# EAGLE design connector_board (EAGLE 9.5.2)
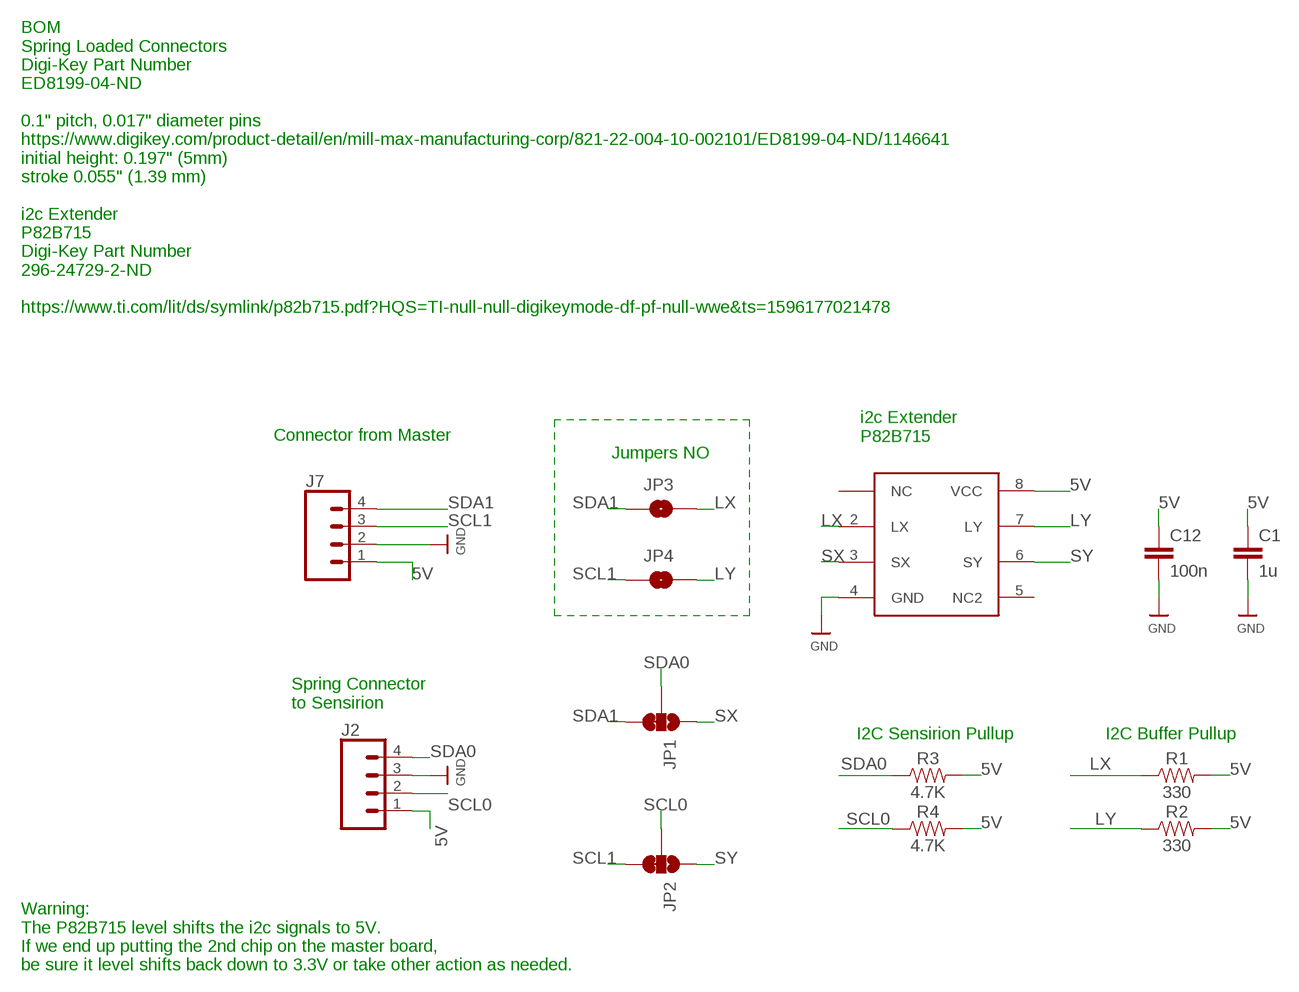
[diagram p0: schematic, sheet 1]

## Parts
C1  1u  CAP-0805  [0805]
C12  100n  CAP-0805  [0805]
J2  CONN_0430MILL_DIA  [1X04_30MILL_DIA]
J7  CONN_043.5MM_RA  [1X04_3.5MM_RA]
JP1  JUMPER-SMT_3_1-NC_TRACE_NO-SILK  [SMT-JUMPER_3_1-NC_TRACE_NO-SILK]
JP2  JUMPER-SMT_3_1-NC_TRACE_NO-SILK  [SMT-JUMPER_3_1-NC_TRACE_NO-SILK]
JP3  JUMPER-SMT_2_NO_SILK  [SMT-JUMPER_2_NO_SILK]
JP4  JUMPER-SMT_2_NO_SILK  [SMT-JUMPER_2_NO_SILK]
R1  330  0.3OHM-0805-1/8W-1%  [0805]
R2  330  0.3OHM-0805-1/8W-1%  [0805]
R3  4.7K  0.3OHM-0805-1/8W-1%  [0805]
R4  4.7K  0.3OHM-0805-1/8W-1%  [0805]
U$2  P82B715  [SOIC8]

## Nets
5V: C1.1 C12.1 J2.1 J7.1 R1.2 R2.2 R3.2 R4.2 U$2.8(VCC)
GND: C1.2 C12.2 J2.3 J7.2 U$2.4(GND)
LX: JP3.2 R1.1 U$2.2(LX)
LY: JP4.2 R2.1 U$2.7(LY)
SCL0: J2.2 JP2.2 R4.1
SCL1: J7.3 JP2.3 JP4.1
SDA0: J2.4 JP1.2 R3.1
SDA1: J7.4 JP1.3 JP3.1
SX: JP1.1 U$2.3(SX)
SY: JP2.1 U$2.6(SY)
Unconnected: U$2.1(NC) U$2.5(NC2)

## Notes on the sheet
- BOM
  Spring Loaded Connectors 
  Digi-Key Part Number
  ED8199-04-ND
  
  0.1" pitch, 0.017" diameter pins
  https://www.digikey.com/product-detail/en/mill-max-manufacturing-corp/821-22-004-10-002101/ED8199-04-ND/1146641
  initial height: 0.197" (5mm)
  stroke 0.055" (1.39 mm)
  
  i2c Extender
  P82B715 
  Digi-Key Part Number
  296-24729-2-ND
  
  https://www.ti.com/lit/ds/symlink/p82b715.pdf?HQS=TI-null-null-digikeymode-df-pf-null-wwe&ts=1596177021478
- i2c Extender
  P82B715
- Connector from Master
- Jumpers NO
- Spring Connector
  to Sensirion
- I2C Sensirion Pullup | I2C Buffer Pullup
- Warning:
  The P82B715 level shifts the i2c signals to 5V.
  If we end up putting the 2nd chip on the master board, 
  be sure it level shifts back down to 3.3V or take other action as needed.

## Library data of the parts
C1 C12 = SparkFun-Capacitors:CAP
J2 J7 = th_libraries:CONN_04: Multi connection point. Often used as Generic Header-pin footprint for 0.1 inch spaced/style header connections On any of the 0.1 inch spaced packages, you can populate with these: Break Away Headers - Straight <https://www.sparkfun.com/products/116> (PRT-00116) Break Away Male Headers - Right Angle <https://www.sparkfun.com/products/553> (PRT-00553) Female Headers <https://www.sparkfun.com/products/115> (PRT-00115) Break Away Headers - Machine Pin <https://www.sparkfun.com/products/117> (PRT-00117) Break Away Female Headers - Swiss Machine Pin <https://www.sparkfun.com/products/743> (PRT-00743) For SCREWTERMINALS and SPRING TERMINALS visit here: Screw Terimnals on SparkFun.com <https://www.sparkfun.com/search/results?term=Screw+Terminals> (5mm/3.5mm/2.54mm spacing) This device is also useful as a general connection point to wire up your design to another part of your project. Our various solder wires solder well into these plated through hole pads. Hook-Up Wire - Assortment (Stranded, 22 AWG) <https://www.sparkfun.com/products/11375> (PRT-11375) Hook-Up Wire - Assortment (Solid Core, 22 AWG) <https://www.sparkfun.com/products/11367> (PRT-11367) View the entire wire category on our website here <https://www.sparkfun.com/categories/141> Special notes: Molex polarized connector foot print use with SKU : PRT-08231 with associated crimp pins and housings. 1MM SMD Version SKU: PRT-10208
JP1 JP2 = SparkFun-Jumpers:JUMPER-SMT_3_1-NC_TRACE: Normally closed trace jumper (1 of 2 connections) This jumper has a trace between two pads so it's normally closed (NC). The other connection is normally open (NO). Use a razor knife to open the connection. For best results follow the IPC guidelines for cutting traces: Cutout at least 0.063 mm (0.005 in). Remove all loose material to clean up the cut area. Seal the cut with an approved epoxy. Reapply solder to reclose the connection, or to close the NO connection.
JP3 JP4 = SparkFun-Jumpers:JUMPER-SMT_2_NO: Normally open jumper This jumper has two pads in close proximity to each other. Apply solder to close the connection. Round pads are easier to solder for beginners, but are a lot larger. SparkFun Product that uses the round pads: SparkFun EL Sequencer <https://www.sparkfun.com/products/12781>
R1-R4 = SparkFun-Resistors:0.3OHM: 0.3Ω resistor A resistor is a passive two-terminal electrical component that implements electrical resistance as a circuit element. Resistors act to reduce current flow, and, at the same time, act to lower voltage levels within circuits. - Wikipedia; PROD_ID: RES-11622; VALUE: 0.3
U$2 = th_libraries:P82B715: i2c Extender P82B715 https://www.nxp.com/docs/en/data-sheet/P82B715.pdf Soic8

## Board
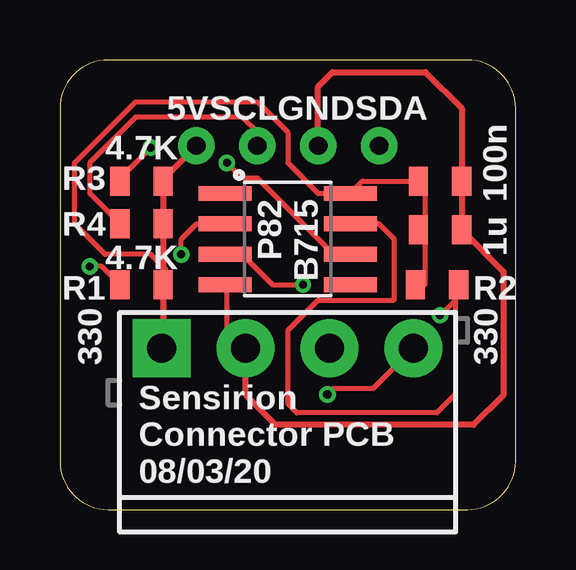
[diagram p1: board, top side]
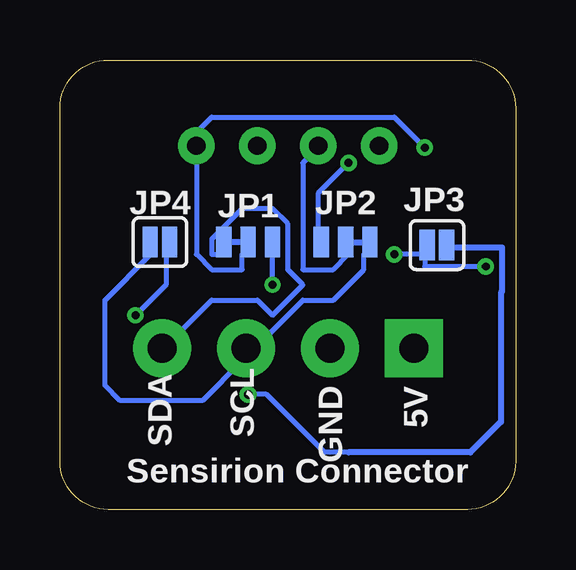
[diagram p2: board, bottom side, seen from below]

Size 19 x 18.73 mm. Coordinates in mm from the lower left corner, seen from the top.
Outline: 17,0 arc90 19,2 19,16.73 arc90 17,18.73 2,18.73 arc90 0,16.73 0,2 arc90 2,0 17,0
Copper layers (1*16): Top 0.0356mm / dielectric 1.5011mm / Bottom 0.0356mm
Design rules "LaenPCBOrder *": minimum track width 8mil, minimum drill 13mil, track to track 8mil, track to pad 8mil, pad to pad 8mil, via to via 8mil, smd to smd 6mil, copper to edge 15mil, drill to drill 6mil, minimum pad ring 7mil, minimum via ring 7mil, stop-mask expansion 3mil, vias tented up to drill 25mil, thermal gap 10mil

### Footprints (pad centres in the part's own frame; a part is rotated, then mirrored left to right if it is on the bottom)
0805 = smd 0.8 x 1.2: 1 -0.9,0; 2 0.9,0
1X04_30MILL_DIA = drill 0.762 pad 1.524: 1 0,0; 2 2.54,0; 3 5.08,0; 4 7.62,0
1X04_3.5MM_RA = drill 1.2 pad 2.413 square: 1 -0.228,0.023 | drill 1.2 pad 2.413: 2 3.272,0.023; 3 6.772,0.023; 4 10.272,0.023
SMT-JUMPER_3_1-NC_TRACE_NO-SILK = smd 0.635 x 1.27: 1 -1.016,0; 2 0,0; 3 1.016,0
SMT-JUMPER_2_NO_SILK = smd 0.635 x 1.27: 1 -0.406,0; 2 0.406,0
SOIC8 = smd 0.61 x 2.21: 1 -1.905,-2.616; 2 -0.635,-2.616; 3 0.635,-2.616; 4 1.905,-2.616; 5 1.905,2.616; 6 0.635,2.616; 7 -0.635,2.616; 8 -1.905,2.616

### Placement (x,y rotation side)
C1  15.85,11.65 0 top
C12  15.85,13.68 0 top
J2  5.69,15.16 0 top
J7  4.47,6.7 0 top
JP1  11.15,11.14 180 bottom
JP2  7.09,11.14 0 bottom
JP3  3.28,11.02 180 bottom
JP4  14.83,11.14 0 bottom
R1  3.4,9.37 0 top
R2  15.72,9.37 180 top
R3  3.4,13.68 0 top
R4  3.4,11.9 0 top
U$2  9.5,11.27 270 top

### Tracks (layer width: path | path; a pad name or v marks a point on that pad's centre or on a via)
5V
  Top 0.203: R2.2 15.21,9.37 15.21,11.27 C1.1 15.21,11.9 15.21,13.18 C12.1 12.62,13.68 U$2.8 10.77,13.18 9.5,14.44 9.5,15.71 8.23,16.99 3.15,16.99 0.61,14.44 0.61,11.9 1.88,10.63 3.78,10.63 4.42,10 4.3,10
  Top 0.254: J2.1 4.3,13.77 R3.2 R4.2 4.3,10 R1.2 4.3,6.78 J7.1
GND
  Top 0.203: U$2.4 6.96,9.37 6.96,7.46 7.59,6.82 J7.2
  Top 0.254: J2.3 10.77,17.62 11.37,18.22 15.25,18.22 16.75,16.72 C12.2 C1.2 18.49,9.91 18.49,4.77 17.25,3.52 8.99,3.52 7.74,4.77 J7.2
LX  (via drill 0.33)
  Top 0.203: v1.25,10.13 1.74,10.13 R1.1 2.51,9.37 | U$2.2 5.69,11.9 5.06,11.27 v5.06,10.63
  Bottom 0.203: v1.25,10.13 3.78,10.13 3.78,10.63 | 3.78,10.63 v5.06,10.63 | 3.78,10.63 JP3.2
LY  (via drill 0.33)
  Top 0.203: 16.49,8.73 16.49,9.37 R2.1 | v15.85,8.09 16.49,8.73 | U$2.7 13.31,11.9 13.94,11.27 13.94,8.73 10.77,8.73 9.5,7.46 9.5,4.41 9.88,4.03 15.72,4.03 16.49,4.79 16.49,8.73
  Bottom 0.203: v15.85,8.09 14.58,9.37 14.58,10.63 JP4.2
SCL0
  Top 0.203: R4.1 2.51,11.9 1.25,13.18 1.25,14.44 3.15,16.35 7.59,16.35 8.23,15.71 J2.2
  Bottom 0.203: JP2.2 6.96,10.63 7.59,10 8.87,10 8.87,14.44 8.23,15.08 J2.2
SCL1
  Bottom 0.203: JP4.1 15.21,10.63 17.12,8.73 17.12,5.17 16.49,4.54 13.06,4.54 11.4,6.19 J7.3 10.77,6.82 8.87,8.73 7.59,8.73 6.32,10 6.32,10.63 JP2.3
SDA0  (via drill 0.33)
  Top 0.203: v3.78,15.08 2.51,13.81 R3.1
  Bottom 0.203: v3.78,15.08 5.06,16.35 12.68,16.35 13.31,15.71 J2.4 13.31,10.63 12.68,10 11.4,10 11.4,10.63 JP1.2
SDA1  (via drill 0.35)
  Top 0.203: v11.15,4.79 11.4,5.05 13.07,5.05 J7.4
  Bottom 0.203: JP1.3 12.04,10.63 12.68,10.63 12.68,11.27 11.4,12.54 10.13,12.54 9.5,11.9 9.5,10 8.87,9.37 10.13,8.09 10.77,8.73 12.68,8.73 14.58,6.82 J7.4 | 6.96,2.38 7.98,2.38 10.39,4.79 v11.15,4.79
  Bottom 0.254: JP3.1 2.78,10.93 0.57,10.93 0.57,9.09 0.61,9.05 0.61,3.65 1.88,2.38 6.96,2.38
SX  (via drill 0.33)
  Top 0.203: v10.13,9.37 8.87,9.37 7.59,10.63 U$2.3
  Bottom 0.203: v10.13,9.37 JP1.1
SY  (via drill 0.33)
  Top 0.203: v6.96,14.44 7.59,13.81 8.23,13.81 11.4,10.63 U$2.6
  Bottom 0.203: v6.96,14.44 8.23,13.18 8.23,11.27 JP2.1

### Text on the board
tPlace: 5V | SCL | GND | SDA | P82 / B715 | Sensirion / Connector PCB / 08/03/20
bPlace: GND | 5V | SCL | SDA | Sensirion Connector